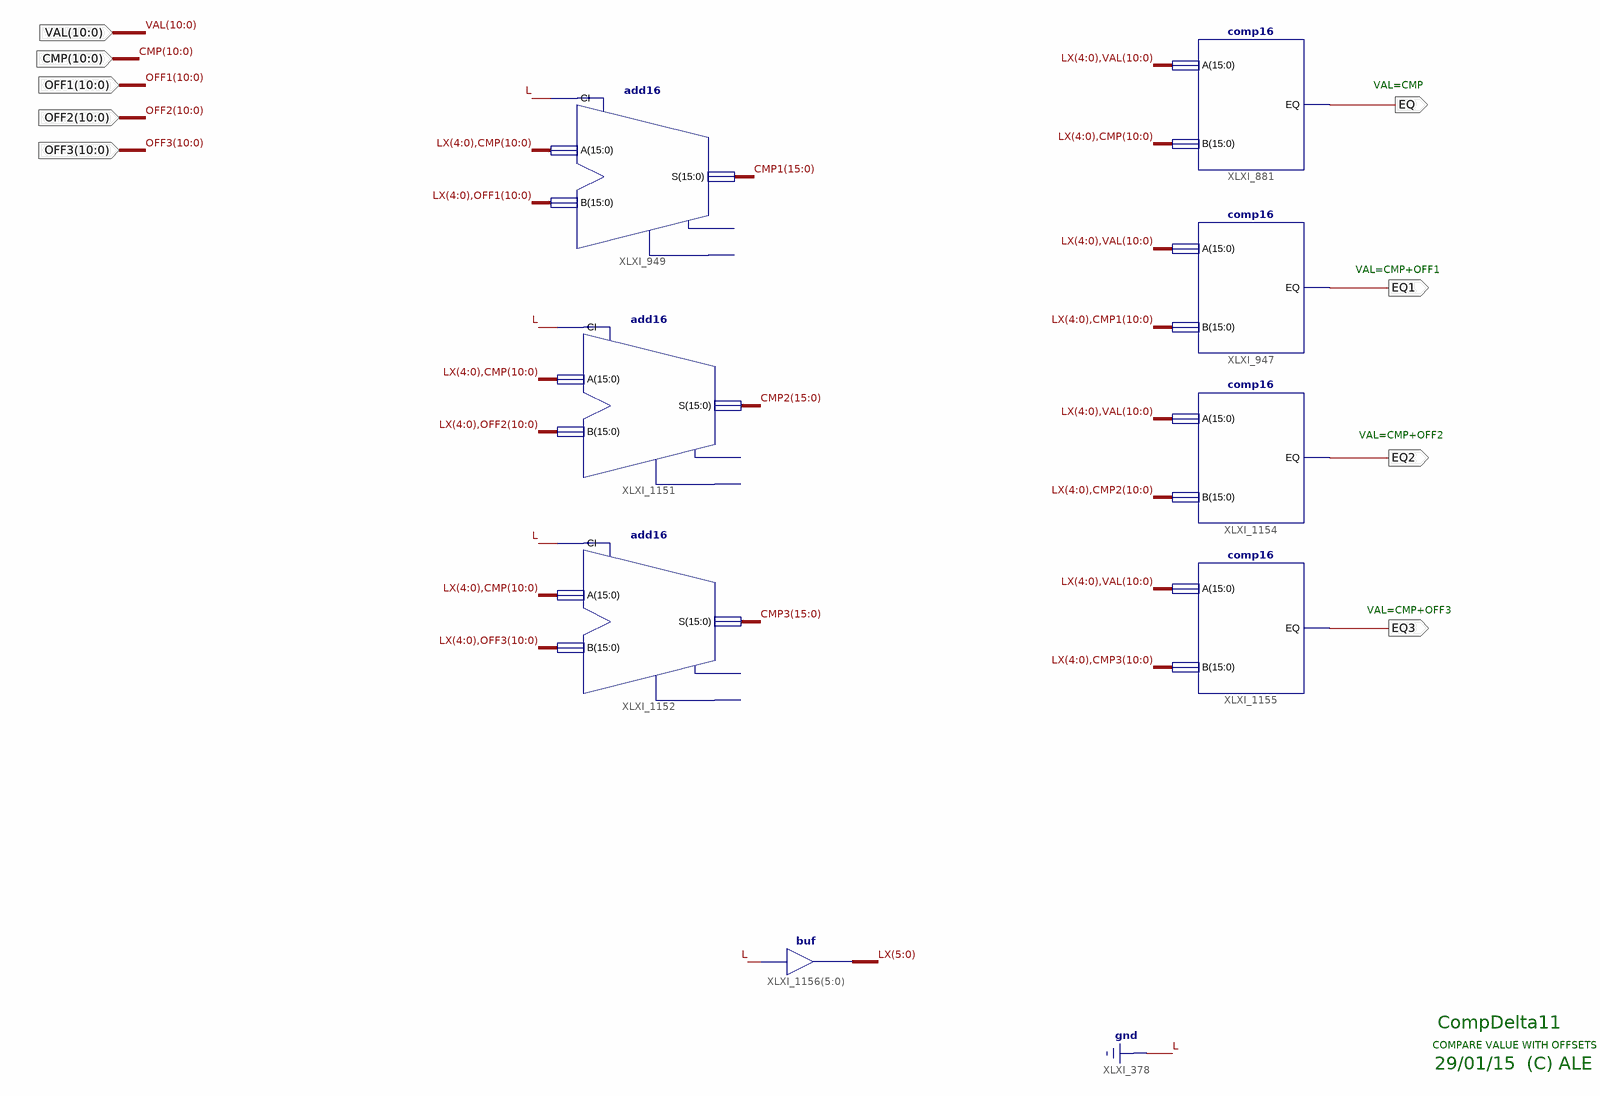
[diagram p0: schematic sheet 1]
// Xilinx ISE schematic CompDelta11.sch (spartan3e) as structural Verilog: 8 symbols, 9 ports
module CompDelta11 (
  input  [10:0] VAL,
  input  [10:0] CMP,
  input  [10:0] OFF3,
  input  [10:0] OFF2,
  input  [10:0] OFF1,
  output EQ,
  output EQ1,
  output EQ2,
  output EQ3
);

  wire [5:0] LX;
  wire [15:0] CMP1, CMP2, CMP3;

  comp16 XLXI_881 (.A({LX[4:0], VAL}), .B({LX[4:0], CMP}), .EQ(EQ));
  comp16 XLXI_947 (.A({LX[4:0], VAL}), .B({LX[4:0], CMP1[10:0]}), .EQ(EQ1));
  add16 XLXI_949 (.A({LX[4:0], CMP}), .B({LX[4:0], OFF1}), .CI(1'b0), .S(CMP1));  // open: CO, OFL
  add16 XLXI_1151 (.A({LX[4:0], CMP}), .B({LX[4:0], OFF2}), .CI(1'b0), .S(CMP2));  // open: CO, OFL
  add16 XLXI_1152 (.A({LX[4:0], CMP}), .B({LX[4:0], OFF3}), .CI(1'b0), .S(CMP3));  // open: CO, OFL
  comp16 XLXI_1154 (.A({LX[4:0], VAL}), .B({LX[4:0], CMP2[10:0]}), .EQ(EQ2));
  comp16 XLXI_1155 (.A({LX[4:0], VAL}), .B({LX[4:0], CMP3[10:0]}), .EQ(EQ3));
  assign LX = {6{1'b0}};  // buf XLXI_1156[5..0], 6 bits wide

  // Notes on the sheet:
  //   VAL=CMP
  //   VAL=CMP+OFF1
  //   VAL=CMP+OFF2
  //   VAL=CMP+OFF3
  //   CompDelta11
  //   COMPARE VALUE WITH OFFSETS
  //   29/01/15  (C) ALE
endmodule
